# Altium schematic sheet DBL 165 SerialIn Register.SchDoc: DBL 165 Serial In Register
size A4; Organization: Controlled by GND; Revision: 1.0; SheetTotal: 1; DocumentName: DBL 165 Serial In Register; ProjectName: LightControl
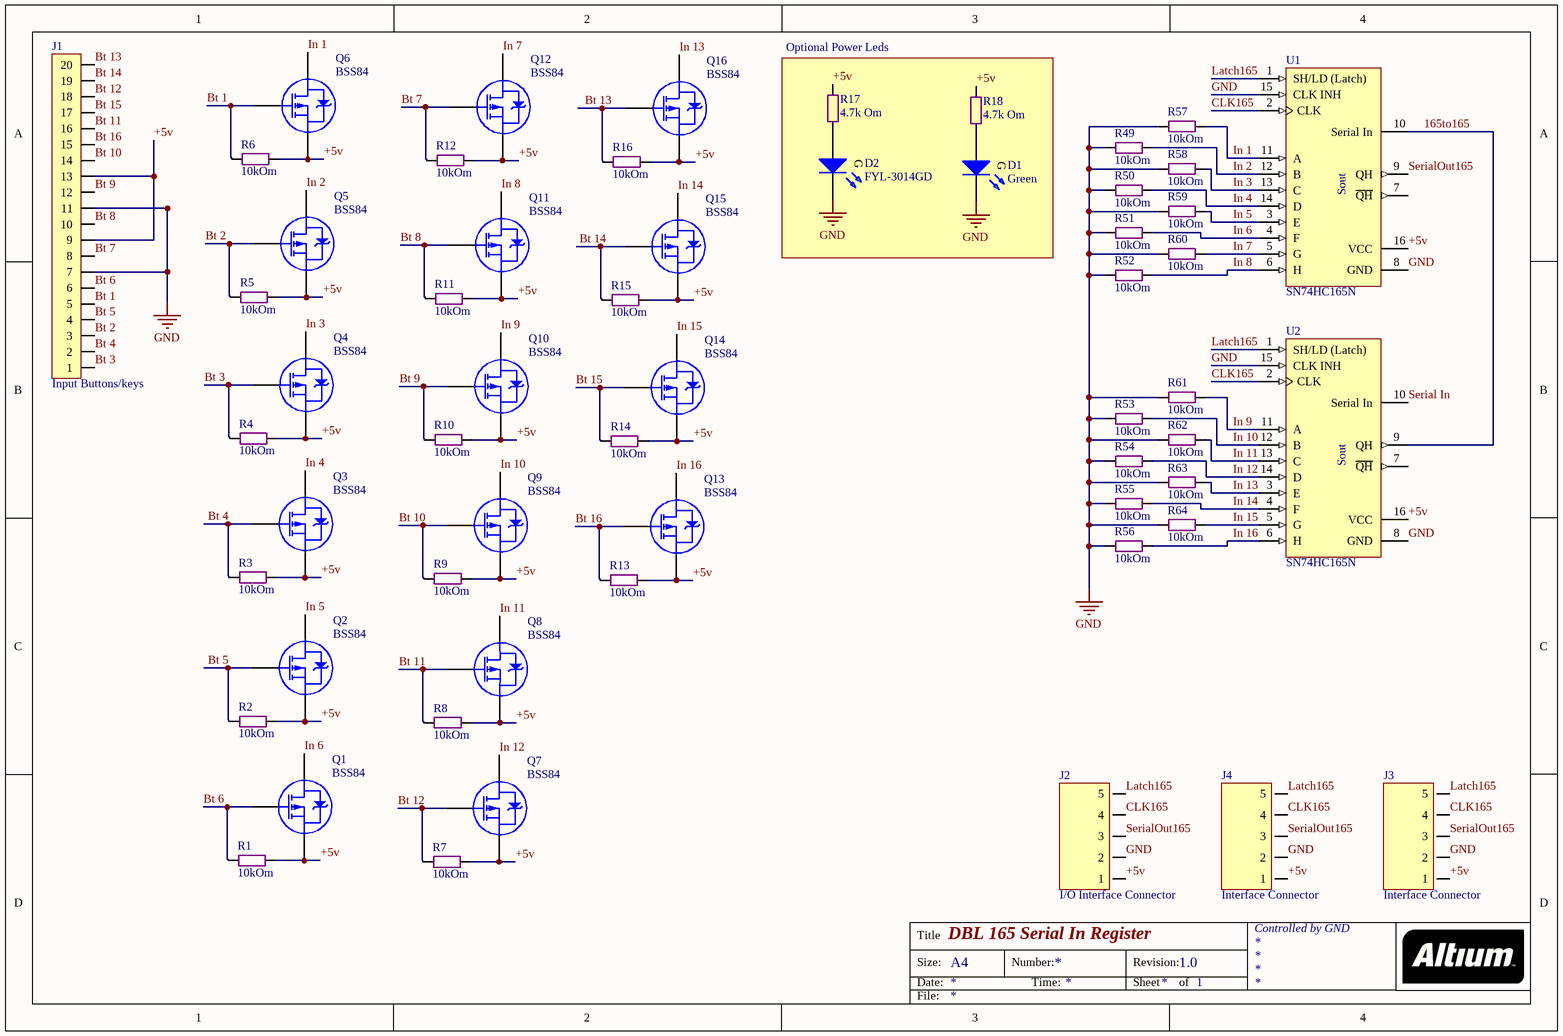
[diagram p0: DBL 165 SerialIn Register.SchDoc]

## Parts
D1  Green  [LED SMD 0805 Green]
D2  FYL-3014GD  [LED Round 3mm Green]
J1  Input Buttons/keys  [LINE 2.54 x 20D (2 x 10) - BH]
J2  I/O Interface Connector  [Line 2.54 x 5]
J3  Interface Connector  [Line 2.54 x 5]
J4  Interface Connector  [Line 2.54 x 5]
Q1  BSS84  [SOT-23]
Q2  BSS84  [SOT-23]
Q3  BSS84  [SOT-23]
Q4  BSS84  [SOT-23]
Q5  BSS84  [SOT-23]
Q6  BSS84  [SOT-23]
Q7  BSS84  [SOT-23]
Q8  BSS84  [SOT-23]
Q9  BSS84  [SOT-23]
Q10  BSS84  [SOT-23]
Q11  BSS84  [SOT-23]
Q12  BSS84  [SOT-23]
Q13  BSS84  [SOT-23]
Q14  BSS84  [SOT-23]
Q15  BSS84  [SOT-23]
Q16  BSS84  [SOT-23]
R1  10kOm  [SMD 0805 (2012)]
R2  10kOm  [SMD 0805 (2012)]
R3  10kOm  [SMD 0805 (2012)]
R4  10kOm  [SMD 0805 (2012)]
R5  10kOm  [SMD 0805 (2012)]
R6  10kOm  [SMD 0805 (2012)]
R7  10kOm  [SMD 0805 (2012)]
R8  10kOm  [SMD 0805 (2012)]
R9  10kOm  [SMD 0805 (2012)]
R10  10kOm  [SMD 0805 (2012)]
R11  10kOm  [SMD 0805 (2012)]
R12  10kOm  [SMD 0805 (2012)]
R13  10kOm  [SMD 0805 (2012)]
R14  10kOm  [SMD 0805 (2012)]
R15  10kOm  [SMD 0805 (2012)]
R16  10kOm  [SMD 0805 (2012)]
R17  4.7k Om  [SMD 0805 (2012)]
R18  4.7k Om  [SMD 0805 (2012)]
R49  10kOm  [SMD 0805 (2012)]
R50  10kOm  [SMD 0805 (2012)]
R51  10kOm  [SMD 0805 (2012)]
R52  10kOm  [SMD 0805 (2012)]
R53  10kOm  [SMD 0805 (2012)]
R54  10kOm  [SMD 0805 (2012)]
R55  10kOm  [SMD 0805 (2012)]
R56  10kOm  [SMD 0805 (2012)]
R57  10kOm  [SMD 0805 (2012)]
R58  10kOm  [SMD 0805 (2012)]
R59  10kOm  [SMD 0805 (2012)]
R60  10kOm  [SMD 0805 (2012)]
R61  10kOm  [SMD 0805 (2012)]
R62  10kOm  [SMD 0805 (2012)]
R63  10kOm  [SMD 0805 (2012)]
R64  10kOm  [SMD 0805 (2012)]
U1  SN74HC165N  [DIP-16]
U2  SN74HC165N  [DIP-16]

## Blocks framed on the sheet
Optional Power Leds: D1 D2 R17 R18

## Nets
GND: D1.K D2.K J1.7 J1.11 J2.2 J3.2 J4.2 R49.1 R50.1 R51.1 R52.1 R53.1 R54.1 R55.1 R56.1 R57.1 R58.1 R59.1 R60.1 R61.1 R62.1 R63.1 R64.1 U1.8(GND) U1.15(CLK_INH) U2.8(GND) U2.15(CLK_INH)
165to165: U1.10(Serial_In) U2.9(QH)
+5v: J1.9 J1.13 J2.1 J3.1 J4.1 Q1.3(S) Q2.3(S) Q3.3(S) Q4.3(S) Q5.3(S) Q6.3(S) Q7.3(S) Q8.3(S) Q9.3(S) Q10.3(S) Q11.3(S) Q12.3(S) Q13.3(S) Q14.3(S) Q15.3(S) Q16.3(S) R1.1 R2.1 R3.1 R4.1 R5.1 R6.1 R7.1 R8.1 R9.1 R10.1 R11.1 R12.1 R13.1 R14.1 R15.1 R16.1 R17.1 R18.1 U1.16(VCC) U2.16(VCC)
Bt 1: J1.5 Q6.1(G) R6.2
Bt 2: J1.3 Q5.1(G) R5.2
Bt 3: J1.1 Q4.1(G) R4.2
Bt 4: J1.2 Q3.1(G) R3.2
Bt 5: J1.4 Q2.1(G) R2.2
Bt 6: J1.6 Q1.1(G) R1.2
Bt 7: J1.8 Q12.1(G) R12.2
Bt 8: J1.10 Q11.1(G) R11.2
Bt 9: J1.12 Q10.1(G) R10.2
Bt 10: J1.14 Q9.1(G) R9.2
Bt 11: J1.16 Q8.1(G) R8.2
Bt 12: J1.18 Q7.1(G) R7.2
Bt 13: J1.20 Q16.1(G) R16.2
Bt 14: J1.19 Q15.1(G) R15.2
Bt 15: J1.17 Q14.1(G) R14.2
Bt 16: J1.15 Q13.1(G) R13.2
CLK165: J2.4 J3.4 J4.4 U1.2(CLK) U2.2(CLK)
In 1: Q6.2(D) R57.2 U1.11(A)
In 2: Q5.2(D) R49.2 U1.12(B)
In 3: Q4.2(D) R58.2 U1.13(C)
In 4: Q3.2(D) R50.2 U1.14(D)
In 5: Q2.2(D) R59.2 U1.3(E)
In 6: Q1.2(D) R51.2 U1.4(F)
In 7: Q12.2(D) R60.2 U1.5(G)
In 8: Q11.2(D) R52.2 U1.6(H)
In 9: Q10.2(D) R61.2 U2.11(A)
In 10: Q9.2(D) R53.2 U2.12(B)
In 11: Q8.2(D) R62.2 U2.13(C)
In 12: Q7.2(D) R54.2 U2.14(D)
In 13: Q16.2(D) R63.2 U2.3(E)
In 14: Q15.2(D) R55.2 U2.4(F)
In 15: Q14.2(D) R64.2 U2.5(G)
In 16: Q13.2(D) R56.2 U2.6(H)
Latch165: J2.5 J3.5 J4.5 U1.1(SH/LD_(Latch)) U2.1(SH/LD_(Latch))
Serial In: U2.10(Serial_In)
SerialOut165: J2.3 J3.3 J4.3 U1.9(QH)
NetD1_A: D1.A R18.2
NetD2_A: D2.A R17.2

Not connected (* = marked no-connect by the designer): U1 7(~{QH}); U2 7(~{QH})

## Notes on the sheet
- Title
- Size:
- Date:
- A4
- Number:
- Time:
- Revision:
- Sheet
- of
- File:
- (in symbol Led Round 3mm Green) G
- (in symbol Led SMD Green) G
- (in symbol SN74HC165N) Sout

## Library data of the parts
D1 = Led SMD Green: ?2v ?20mA; Forward Voltage TYP: ?2; Resistor for 5v VCC: 330 Om; Forward Voltage Min: ?; Wave len min/typ: ?; Liminous Min (mcd): ?; Liminous Typ (mcd): ?; Forward Amp (mA): ?; Color: Green
D2 = Led Round 3mm Green: 2.1v 10mA, 15-30mCd; Forward Voltage Max: 2.3; Forward Voltage TYP: 2.1; Wave len min/typ: 570nm; Liminous Typ (mcd): 15-30; Forward Amp (mA): 10; Color: Green; Name: FYL-3014GD
J1 = PLD-20 (2 x 10): Vert, Dbl line, Male
J2-J4 = PLS-5: Vert, Sgl line, Male
Q1-Q16 = BSS84: P-Channel -50V - 10-1Ω - 0.13A; Monufacturer: Farchild; V DSS (v): 60; RDS: <10Om; Open Voltage: -0.8...-2.0 V; I d - Drain current (continuous) at TC = 25°C: 0.13 A; Name: BSS84; Datasheet: http://tec.org.ru/board/0-0-0-515-20
R1-R18 R49-R64 = Res All Types
U1 U2 = SN74HC165N: 8-Bit Parallel-Load Shift Register; Published: 8-Jun-2000; LatestRevisionDate: 04-Mar-2005; LatestRevisionNote: Stylized 3D Model Added.; DatasheetVersion: May-1997; PackageVersion: Oct-1995; PackageReference: N016; Publisher: Altium Limited; PackageDescription: DIP; 16 Leads; Row Spacing 7.62 mm; Pitch 2.54 mm; Code_JEDEC: MS-001-BB; ComponentLink1Description: Manufacturer Link; ComponentLink1URL: http://www.ti.com/; ComponentLink2Description: Datasheet; ComponentLink2URL: http://www-s.ti.com/sc/ds/sn74hc165.pdf